# Altium schematic sheet MCU.SchDoc
size A4
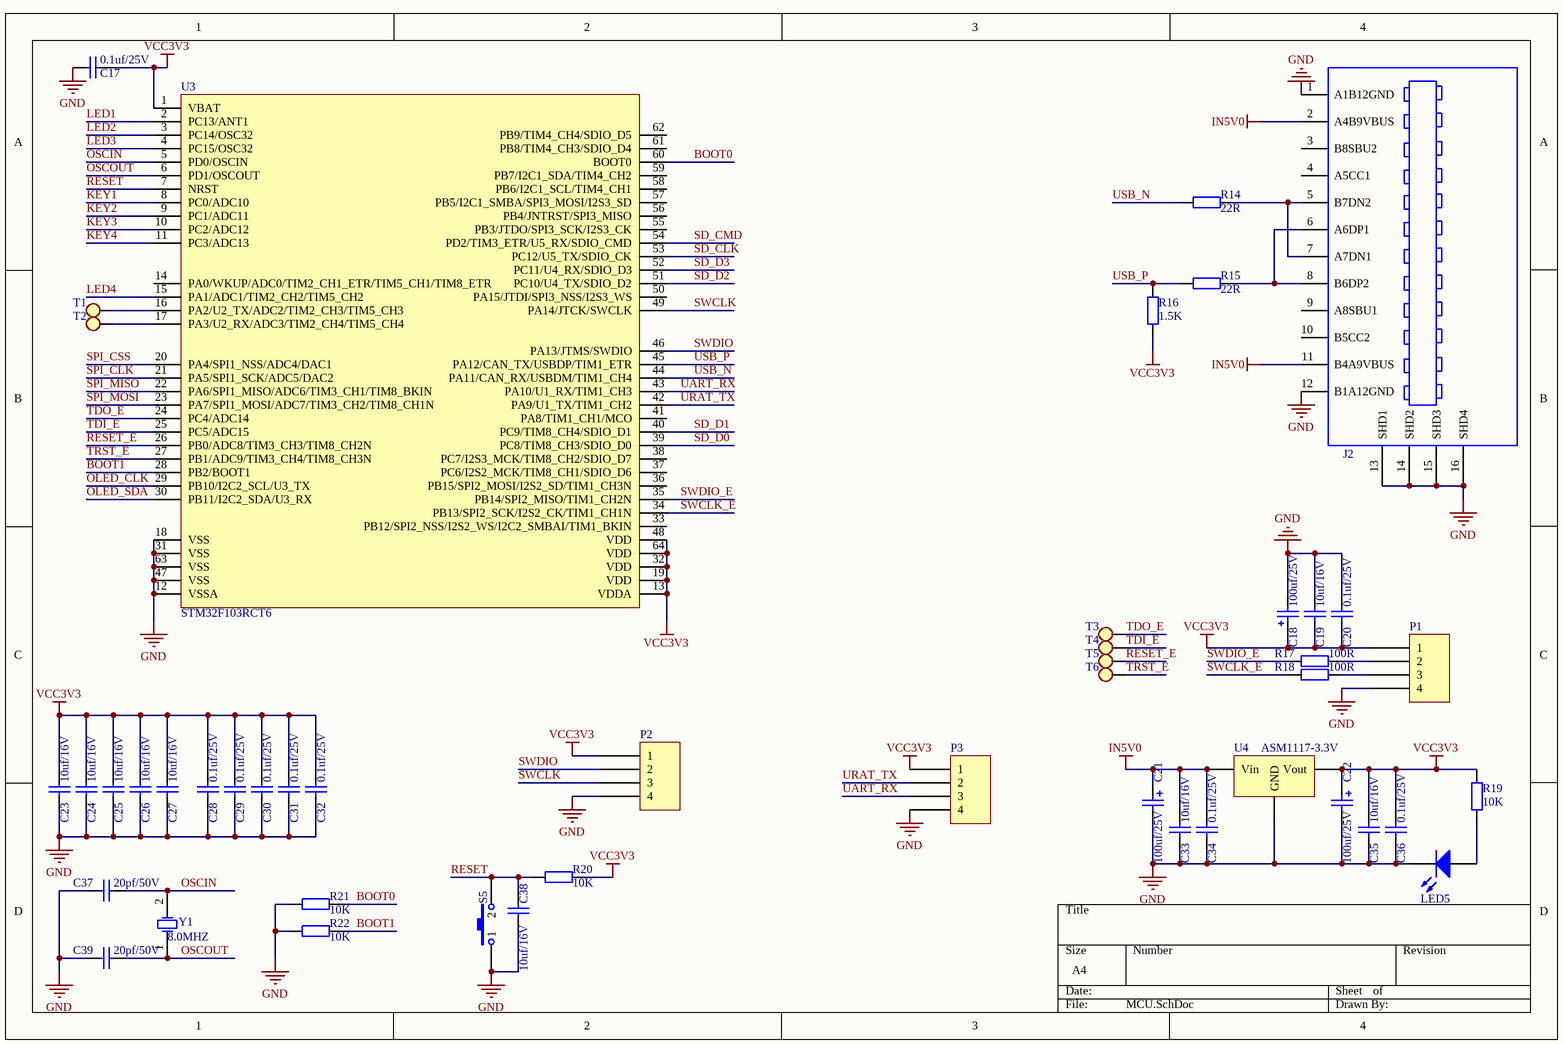
[diagram p0: MCU.SchDoc]

## Parts
C17  0.1uf/25V  [C_0603]
C18  100uf/25V  [C_6.3*5.4]
C19  10uf/16V  [C_0603]
C20  0.1uf/25V  [C_0603]
C21  100uf/25V  [C_6.3*5.4]
C22  100uf/25V  [C_6.3*5.4]
C23  10uf/16V  [C_0603]
C24  10uf/16V  [C_0603]
C25  10uf/16V  [C_0603]
C26  10uf/16V  [C_0603]
C27  10uf/16V  [C_0603]
C28  0.1uf/25V  [C_0603]
C29  0.1uf/25V  [C_0603]
C30  0.1uf/25V  [C_0603]
C31  0.1uf/25V  [C_0603]
C32  0.1uf/25V  [C_0603]
C33  10uf/16V  [C_0603]
C34  0.1uf/25V  [C_0603]
C35  10uf/16V  [C_0603]
C36  0.1uf/25V  [C_0603]
C37  20pf/50V  [C_0603]
C38  10uf/16V  [C_0603]
C39  20pf/50V  [C_0603]
J2  USB_TYPEC_YBT_2V0  [USB_TYPEC_YBD_USB31]  (value not drawn)
LED5  19-21SYGC/S530-E2/TR8  [LED_0603]  (value not drawn)
P1  A2543WR-4P-2  [XH2.54-LI-4P]  (value not drawn)
P2  210S-1*4P L=11.6MM镀金  [CON2.54-4P-A-DIP]  (value not drawn)
P3  210S-1*4P L=11.6MM镀金  [CON2.54-4P-A-DIP]  (value not drawn)
R14  22R  [R_0603]
R15  22R  [R_0603]
R16  1.5K  [R_0603]
R17  100R  [R_0603]
R18  100R  [R_0603]
R19  10K  [R_0603]
R20  10K  [R_0603]
R21  10K  [R_0603]
R22  10K  [R_0603]
S5  K2-1107ST-A4SW-06  [SW-2P-6*3-SMT]  (value not drawn)
T1  TEST POINT_SMD  [TEST POINT-SMD]  (value not drawn)
T2  TEST POINT_SMD  [TEST POINT-SMD]  (value not drawn)
T3  TEST POINT_SMD  [TEST POINT-SMD]  (value not drawn)
T4  TEST POINT_SMD  [TEST POINT-SMD]  (value not drawn)
T5  TEST POINT_SMD  [TEST POINT-SMD]  (value not drawn)
T6  TEST POINT_SMD  [TEST POINT-SMD]  (value not drawn)
U3  STM32F103RCT6  [LQFP64]
U4  ASM1117-3.3V  [SOT223]
Y1  8.0MHZ  [XTAL_5032]

## Nets
GND: C17.1 C18.2 C19.2 C20.2 C21.2 C22.2 C23.1 C24.1 C25.1 C26.1 C27.1 C28.1 C29.1 C30.1 C31.1 C32.1 C33.1 C34.1 C35.1 C36.1 C37.1 C38.1 C39.1 J2.1(A1B12GND) J2.12(B1A12GND) J2.13(SHD1) J2.14(SHD2) J2.15(SHD3) J2.16(SHD4) LED5.2(Cathode) P1.4 P2.4 P3.4 R21.1 R22.1 S5.1 U3.12(VSSA) U3.18(VSS) U3.31(VSS) U3.47(VSS) U3.63(VSS) U4.1(GND)
IN5V0: C21.1 C33.2 C34.2 J2.2(A4B9VBUS) J2.11(B4A9VBUS) U4.3(Vin)
VCC3V3: C17.2 C18.1 C19.1 C20.1 C22.1 C23.2 C24.2 C25.2 C26.2 C27.2 C28.2 C29.2 C30.2 C31.2 C32.2 C35.2 C36.2 P1.1 P2.1 P3.1 R16.1 R19.2 R20.2 U3.1(VBAT) U3.13(VDDA) U3.19(VDD) U3.32(VDD) U3.48(VDD) U3.64(VDD) U4.2(Vout)
BOOT0: R21.2 U3.60(BOOT0)
BOOT1: R22.2 U3.28(PB2/BOOT1)
KEY1: U3.8(PC0/ADC10)
KEY2: U3.9(PC1/ADC11)
KEY3: U3.10(PC2/ADC12)
KEY4: U3.11(PC3/ADC13)
LED1: U3.2(PC13/ANT1)
LED2: U3.3(PC14/OSC32)
LED3: U3.4(PC15/OSC32)
LED4: U3.15(PA1/ADC1/TIM2_CH2/TIM5_CH2)
OLED_CLK: U3.29(PB10/I2C2_SCL/U3_TX)
OLED_SDA: U3.30(PB11/I2C2_SDA/U3_RX)
OSCIN: C37.2 U3.5(PD0/OSCIN) Y1.2(OSC2)
OSCOUT: C39.2 U3.6(PD1/OSCOUT) Y1.1(OSC1)
RESET: C38.2 R20.1 S5.2 U3.7(NRST)
RESET_E: T5.1 U3.26(PB0/ADC8/TIM3_CH3/TIM8_CH2N)
SD_CLK: U3.53(PC12/U5_TX/SDIO_CK)
SD_CMD: U3.54(PD2/TIM3_ETR/U5_RX/SDIO_CMD)
SD_D0: U3.39(PC8/TIM8_CH3/SDIO_D0)
SD_D1: U3.40(PC9/TIM8_CH4/SDIO_D1)
SD_D2: U3.51(PC10/U4_TX/SDIO_D2)
SD_D3: U3.52(PC11/U4_RX/SDIO_D3)
SPI_CLK: U3.21(PA5/SPI1_SCK/ADC5/DAC2)
SPI_CSS: U3.20(PA4/SPI1_NSS/ADC4/DAC1)
SPI_MISO: U3.22(PA6/SPI1_MISO/ADC6/TIM3_CH1/TIM8_BKIN)
SPI_MOSI: U3.23(PA7/SPI1_MOSI/ADC7/TIM3_CH2/TIM8_CH1N)
SWCLK: P2.3 U3.49(PA14/JTCK/SWCLK)
SWCLK_E: R18.1 U3.34(PB13/SPI2_SCK/I2S2_CK/TIM1_CH1N)
SWDIO: P2.2 U3.46(PA13/JTMS/SWDIO)
SWDIO_E: R17.1 U3.35(PB14/SPI2_MISO/TIM1_CH2N)
TDI_E: T4.1 U3.25(PC5/ADC15)
TDO_E: T3.1 U3.24(PC4/ADC14)
TRST_E: T6.1 U3.27(PB1/ADC9/TIM3_CH4/TIM8_CH3N)
UART_RX: P3.3 U3.43(PA10/U1_RX/TIM1_CH3)
URAT_TX: P3.2 U3.42(PA9/U1_TX/TIM1_CH2)
USB_N: R14.1 U3.44(PA11/CAN_RX/USBDM/TIM1_CH4)
USB_P: R15.1 R16.2 U3.45(PA12/CAN_TX/USBDP/TIM1_ETR)
NetJ2_5: J2.5(B7DN2) J2.7(A7DN1) R14.2
NetJ2_6: J2.6(A6DP1) J2.8(B6DP2) R15.2
NetLED5_1: LED5.1(Anode) R19.1
NetP1_2: P1.2 R17.2
NetP1_3: P1.3 R18.2
NetT1_1: T1.1 U3.16(PA2/U2_TX/ADC2/TIM2_CH3/TIM5_CH3)
NetT2_1: T2.1 U3.17(PA3/U2_RX/ADC3/TIM2_CH4/TIM5_CH4)

Not connected (* = marked no-connect by the designer): J2 3(B8SBU2) 4(A5CC1) 9(A8SBU1) 10(B5CC2); U3 14(PA0/WKUP/ADC0/TIM2_CH1_ETR/TIM5_CH1/TIM8_ETR) 33(PB12/SPI2_NSS/I2S2_WS/I2C2_SMBAI/TIM1_BKIN) 36(PB15/SPI2_MOSI/I2S2_SD/TIM1_CH3N) 37(PC6/I2S2_MCK/TIM8_CH1/SDIO_D6) 38(PC7/I2S3_MCK/TIM8_CH2/SDIO_D7) 41(PA8/TIM1_CH1/MCO) 50(PA15/JTDI/SPI3_NSS/I2S3_WS) 55(PB3/JTDO/SPI3_SCK/I2S3_CK) 56(PB4/JNTRST/SPI3_MISO) 57(PB5/I2C1_SMBA/SPI3_MOSI/I2S3_SD) 58(PB6/I2C1_SCL/TIM4_CH1) 59(PB7/I2C1_SDA/TIM4_CH2) 61(PB8/TIM4_CH3/SDIO_D4) 62(PB9/TIM4_CH4/SDIO_D5)

## Library data of the parts
C17 C20 C28-C32 C34 C36 = C-0603-0.1uf/25V-10%: 多层片式陶瓷电容器; 精度: 5%; 物料厂家: YAGEO; 原厂订货号: CC0603JRX7R8BB104; 封装: C_0603; 描述: 多层片式陶瓷电容器; 值: 0.1uf/25V
C18 C21 C22 = C-6.3*5.8mm-100uf/25V-20%: 贴片电解电容; 精度: 20%; 物料厂家: PANASONIC; 封装: C_6.3*5.8; 原厂订货号: EEEFK1E101SP; 描述: 贴片电解电容; 值: 100uf/25V
C19 C23-C27 C33 C35 C38 = C-0603-10uf/16V-10%: 多层片式陶瓷电容器; 精度: 10%; 物料厂家: muRata; 原厂订货号: GRM188R61C106KAALD; 封装: C_0603; 描述: 多层片式陶瓷电容器; 值: 10uf/16V
C37 C39 = C-0603-20pf/50V-5%: 多层片式陶瓷电容器; 精度: 5%; 物料厂家: Yageo; 原厂订货号: AC0603JRNPO9BN200; 封装: C_0603; 描述: 多层片式陶瓷电容器; 值: 20pf/50V
J2 = USB_TYPEC_YBT_2V0: type-c母座16pin 快充闪充usb3.0沉板母座连接; 值: TYPE-C16PIN; 封装: SMD; 物料厂家: SHOU HAN(首韩); 原厂订货号: TYPE-C16PIN; 慧医谷物料编号: *; 描述: type-c母座16pin 快充闪充usb3.0沉板母座连接; 精度: *
LED5 = LED1_19-21SYGC/S530-E2/TR8: 发光二极管0603黄绿色; 物料厂家: EVERLIGHT; 描述: 发光二极管   发光二极管 黄绿色 21mcd@20mA; 封装: 0603; 原厂订货号: 19-21SYGC/S530-E2/TR8; 值: 19-21SYGC/S530-E2/TR8
P1 = Header 4*1   2.54mm直插  A2543WR-4P-2: 封装: Through Hole，Pin=2.54mm,4P; 物料厂家: CJT; 原厂订货号: A2543WR-4P-2; 描述: A2543WR-4P-2; 值: A2543WR-4P-2
P2 P3 = Header 4*1   2.54mm直插  210S-1*4P L=11.6MM镀金: 封装: Through Hole，Pin=2.54mm,4P; 物料厂家: Ckmtw; 描述: 直插单排针2.54MM-4P 针长11MM 镀金; 原厂订货号: 210S-1*4P L=11.6MM镀金; 值: 210S-1*4P L=11.6MM镀金
R14 R15 = R-0603-22R-1%: 通用电阻; 精度: 1%; 物料厂家: Yageo; 描述: 薄膜精密电阻; 原厂订货号: AC0603FR-0722RL; 封装: R_0603; 值: 22R
R16 = R-0603-1.5K-1%: 通用电阻; 精度: 1%; 物料厂家: Yageo; 描述: 薄膜精密电阻; 原厂订货号: RC0603FR-071K5L; 封装: R_0603; 值: 1.5K
R17 R18 = R-0603-100R-1%: 通用电阻; 精度: 1%; 物料厂家: Yageo; 描述: 薄膜精密电阻; 原厂订货号: AC0603FR-07100RL; 封装: R_0603; 值: 100R
R19-R22 = R-0603-10K-1%: 通用电阻; 精度: 1%; 物料厂家: Yageo; 描述: 薄膜精密电阻; 原厂订货号: AC0603FR-0710KL; 封装: R_0603; 值: 10K
S5 = KEY_K2-1107ST-A4SW-06: 轻触开关3.6*6.1*2.5; 描述: 轻触开关 3.6*6.1*2.5 灰头; 物料厂家: 韩国韩荣; 原厂订货号: K2-1107ST-A4SW-06; 封装: 3.6*6.1*2.5; 值: K2-1107ST-A4SW-06
T1-T6 = TEST POINT_SMD: 测试点; 封装: SMD; 原厂订货号: TEST POINT_SMD; 描述: 测试点; 值: TEST POINT_SMD
U3 = STM32F103RCT6: Cortex-M3核心ARM控制器 72MHz主频 64pin引脚LQFP64; 物料厂家: ST; 原厂订货号: STM32F103RCT6; 描述: Cortex-M3核心ARM控制器 72MHz主频 64pin引脚; 精度: *; 封装: LQFP64; 值: STM32F103RCT6
U4 = ASM1117-3.3V: 三端稳压器; 物料厂家: KEXIN; 原厂订货号: ASM1117-3.3V; 封装: SOT223; 描述: 三端稳压器; 值: ASM1117-3.3V; 精度: *
Y1 = XTAL_ABM3B-8.000MHZ-10-1-U-T: 晶体振荡器  5032-2P   8M; 物料厂家: ABRACON; 描述: GLASS晶体振荡器; 原厂订货号: ABM3B-8.000MHZ-10-1-U-T; 封装: XTAL_5032; 值: 8.0MHZ